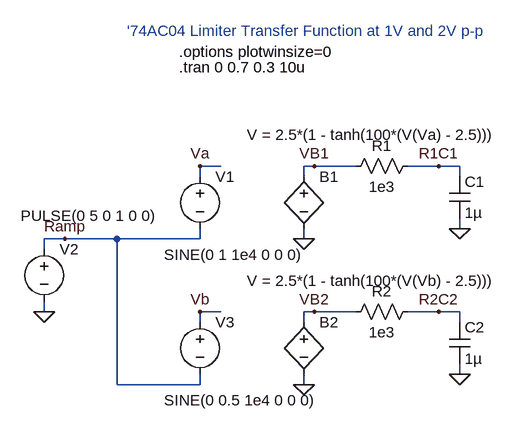
[diagram p0: schematic aclim02.asc]
aclim02.asc, the LTspice schematic file:
Version 4
SHEET 1 1260 864
WIRE -464 144 -496 144
WIRE -320 144 -336 144
WIRE -256 144 -320 144
WIRE -128 144 -176 144
WIRE -96 144 -128 144
WIRE -496 160 -496 144
WIRE -336 160 -336 144
WIRE -96 160 -96 144
WIRE -96 240 -96 224
WIRE -704 256 -736 256
WIRE -624 256 -704 256
WIRE -496 256 -496 240
WIRE -496 256 -624 256
WIRE -336 256 -336 240
WIRE -736 272 -736 256
WIRE -736 368 -736 352
WIRE -464 368 -496 368
WIRE -320 368 -336 368
WIRE -256 368 -320 368
WIRE -128 368 -176 368
WIRE -96 368 -128 368
WIRE -496 384 -496 368
WIRE -336 384 -336 368
WIRE -96 384 -96 368
WIRE -96 464 -96 448
WIRE -624 480 -624 256
WIRE -496 480 -496 464
WIRE -496 480 -624 480
WIRE -336 480 -336 464
FLAG -736 368 0
FLAG -496 144 Va
FLAG -96 240 0
FLAG -336 256 0
FLAG -128 144 R1C1
FLAG -704 256 Ramp
FLAG -320 144 VB1
FLAG -496 368 Vb
FLAG -96 464 0
FLAG -336 480 0
FLAG -128 368 R2C2
FLAG -320 368 VB2
SYMBOL Voltage -496 144 R0
WINDOW 123 0 0 Left 0
WINDOW 39 0 0 Left 0
WINDOW 3 -55 136 Left 0
SYMATTR Value SINE(0 1 1e4 0 0 0)
SYMATTR InstName V1
SYMBOL cap -112 160 R0
SYMATTR InstName C1
SYMATTR Value 1µ
SYMBOL bv -336 144 R0
WINDOW 3 -88 -48 Left 0
SYMATTR Value V = 2.5*(1 - tanh(100*(V(Va) - 2.5)))
SYMATTR InstName B1
SYMBOL res -272 160 R270
WINDOW 0 32 56 VTop 0
WINDOW 3 0 56 VBottom 0
SYMATTR InstName R1
SYMATTR Value 1e3
SYMBOL Voltage -736 256 R0
WINDOW 123 0 0 Left 0
WINDOW 39 0 0 Left 0
WINDOW 3 -36 -36 Left 0
SYMATTR Value PULSE(0 5 0 1 0 0)
SYMATTR InstName V2
SYMBOL Voltage -496 368 R0
WINDOW 123 0 0 Left 0
WINDOW 39 0 0 Left 0
WINDOW 3 -55 136 Left 0
SYMATTR Value SINE(0 0.5 1e4 0 0 0)
SYMATTR InstName V3
SYMBOL cap -112 384 R0
SYMATTR InstName C2
SYMATTR Value 1µ
SYMBOL bv -336 368 R0
WINDOW 3 -88 -48 Left 0
SYMATTR Value V = 2.5*(1 - tanh(100*(V(Vb) - 2.5)))
SYMATTR InstName B2
SYMBOL res -272 384 R270
WINDOW 0 32 56 VTop 0
WINDOW 3 0 56 VBottom 0
SYMATTR InstName R2
SYMATTR Value 1e3
TEXT -608 -64 Left 0 ;'74AC04 Limiter Transfer Function at 1V and 2V p-p
TEXT -528 -8 Left 0 !.tran 0 0.7 0.3 10u
TEXT -528 -32 Left 0 !.options plotwinsize=0

The netlist it stands for:
* aclim02.asc
V1 Va Ramp SINE(0 1 1e4 0 0 0)
C1 R1C1 0 1µ
B1 VB1 0 V = 2.5*(1 - tanh(100*(V(Va) - 2.5)))
R1 VB1 R1C1 1e3
V2 Ramp 0 PULSE(0 5 0 1 0 0)
V3 Vb Ramp SINE(0 0.5 1e4 0 0 0)
C2 R2C2 0 1µ
B2 VB2 0 V = 2.5*(1 - tanh(100*(V(Vb) - 2.5)))
R2 VB2 R2C2 1e3
* '74AC04 Limiter Transfer Function at 1V and 2V p-p
.tran 0 0.7 0.3 10u
.options plotwinsize=0
.backanno
.end